# Altium schematic sheet Poster.SchDoc
size 420 x 297 mm; CheckedBy: Суворов; SheetNumber: 2; SheetTotal: 2; DevelopedBy: Паймин
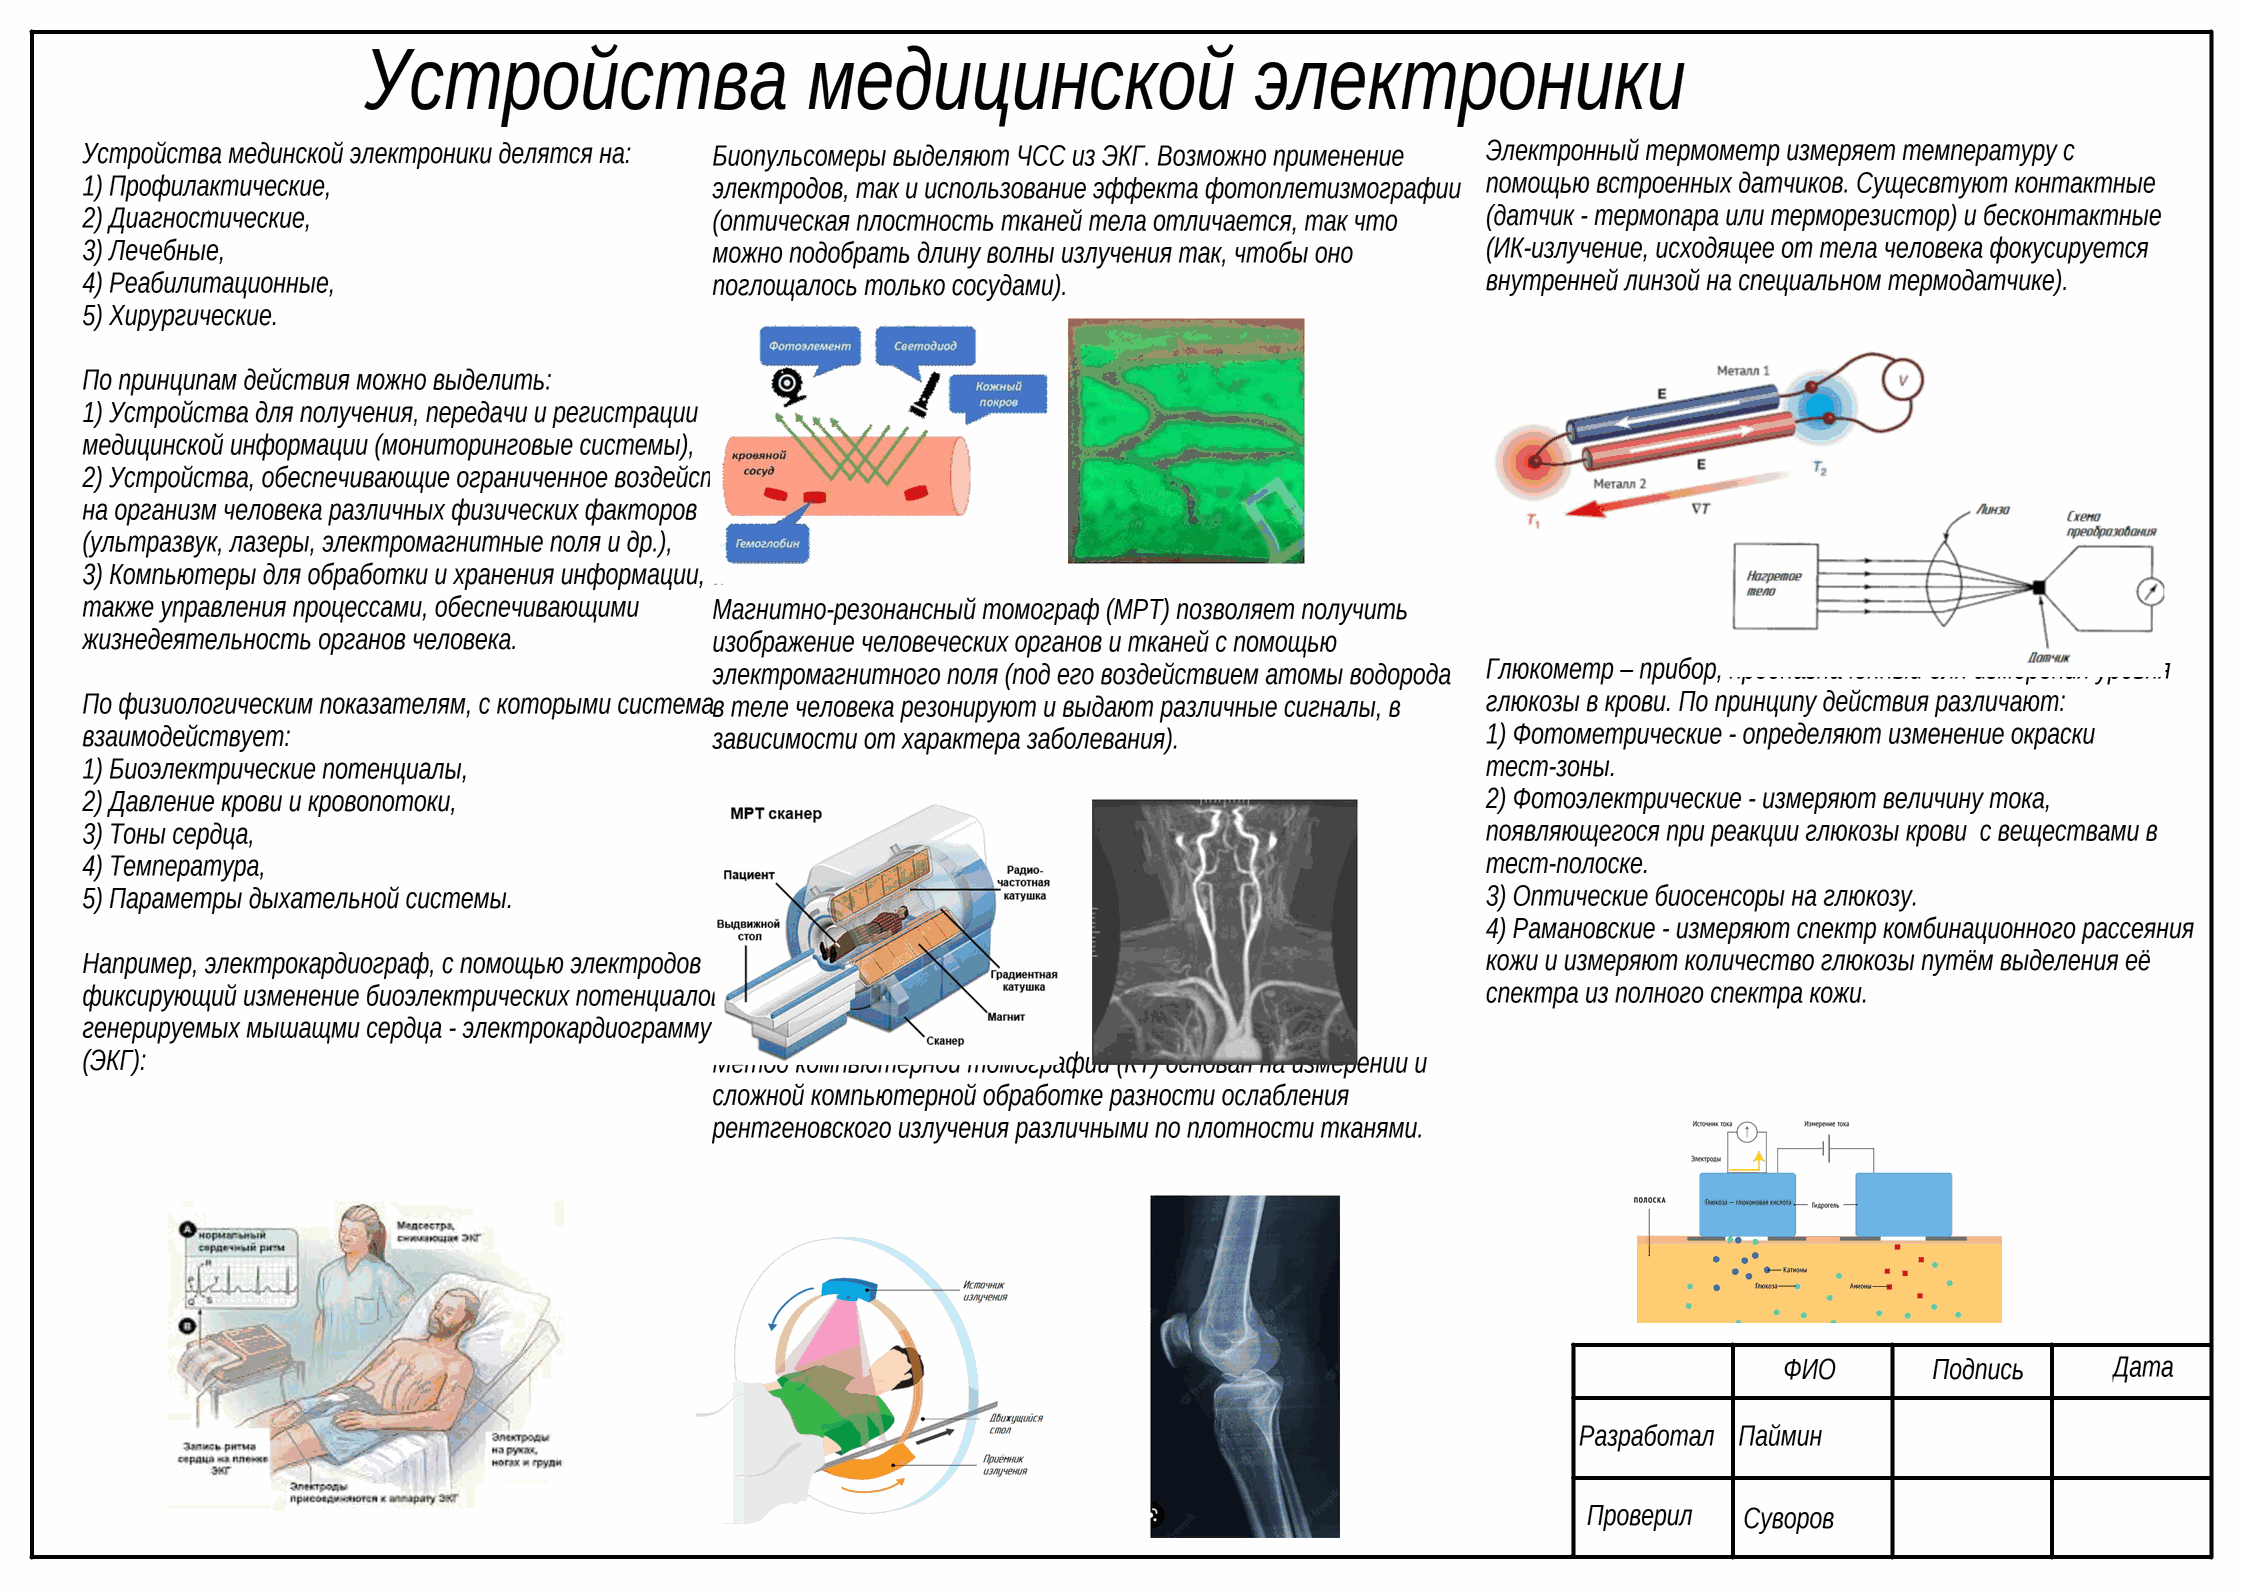
[diagram p0: Poster.SchDoc]

## Notes on the sheet
- Устройства медицинской электроники
- Электронный термометр измеряет температуру с
  помощью встроенных датчиков. Сущесвтуют контактные (датчик - термопара или терморезистор) и бесконтактные (ИК-излучение, исходящее от тела человека фокусируется внутренней линзой на специальном термодатчике).
  Глюкометр – прибор, предназначенный для измерения уровня глюкозы в крови. По принципу действия различают:
  1) Фотометрические - определяют изменение окраски тест-зоны.
  2) Фотоэлектрические - измеряют величину тока, появляющегося при реакции глюкозы крови  с веществами в тест-полоске.
  3) Оптические биосенсоры на глюкозу.
  4) Рамановские - измеряют спектр комбинационного рассеяния кожи и измеряют количество глюкозы путём выделения её спектра из полного спектра кожи.
- Устройства мединской электроники делятся на:
  1) Профилактические,
  2) Диагностические,
  3) Лечебные,
  4) Реабилитационные,
  5) Хирургические.
  По принципам действия можно выделить:
  1) Устройства для получения, передачи и регистрации медицинской информации (мониторинговые системы),
  2) Устройства, обеспечивающие ограниченное воздействие на организм человека различных физических факторов (ультразвук, лазеры, электромагнитные поля и др.),
  3) Компьютеры для обработки и хранения информации, а также управления процессами, обеспечивающими жизнедеятельность органов человека.
  По физиологическим показателям, с которыми система взаимодействует:
  1) Биоэлектрические потенциалы,
  2) Давление крови и кровопотоки,
  3) Тоны сердца,
  4) Температура,
  5) Параметры дыхательной системы.
  Например, электрокардиограф, с помощью электродов фиксирующий изменение биоэлектрических потенциалов, генерируемых мышащми сердца - электрокардиограмму (ЭКГ):
- Биопульсомеры выделяют ЧСС из ЭКГ. Возможно применение электродов, так и использование эффекта фотоплетизмографии (оптическая плостность тканей тела отличается, так что можно подобрать длину волны излучения так, чтобы оно поглощалось только сосудами).
  Магнитно-резонансный томограф (МРТ) позволяет получить изображение человеческих органов и тканей с помощью электромагнитного поля (под его воздействием атомы водорода в теле человека резонируют и выдают различные сигналы, в зависимости от характера заболевания).
  Метод компьютерной томографии (КТ) основан на измерении и сложной компьютерной обработке разности ослабления рентгеновского излучения различными по плотности тканями.
- `
- ФИО
- Подпись
- Дата
- Разработал
- Проверил